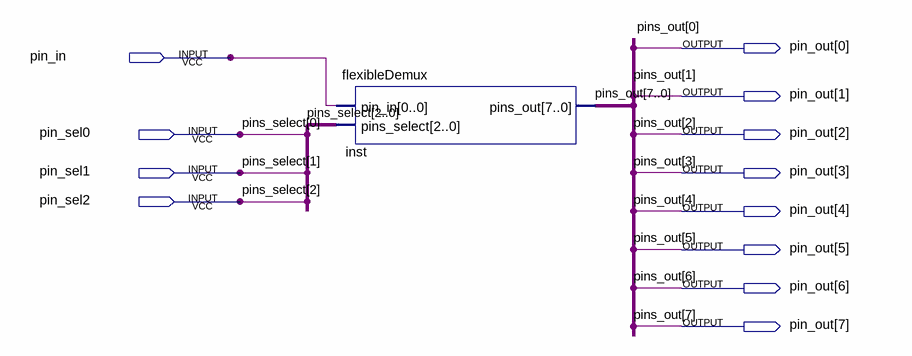
[diagram p0: schematic sheet]
// Quartus schematic PyFlexibleDemultiplexer.bdf as structural Verilog: 1 symbols, 12 pins
module PyFlexibleDemultiplexer (
  input  pin_in,
  input  pin_sel0,
  input  pin_sel1,
  input  pin_sel2,
  output [7:0] pin_out
);

  flexibleDemux inst (.pin_in(pin_in), .pins_select({pin_sel2, pin_sel1, pin_sel0}), .pins_out(pin_out));

  // Other names for the same wires on the sheet: pins_select[2:0] = {pin_sel2, pin_sel1, pin_sel0};
  //   pins_out[7:0] = pin_out
endmodule
